# Altium schematic sheet Deign_1.SchDoc
size A; SheetNumber: 1; SheetTotal: 1; SPICEModelCacheXQTMULPK: <root> / <DocumentId>XQTMULPK</DocumentId> / <CacheFrame Number="0"> / <Model Name="2n3904" Kind="MDL"> / <Text>*2N3904 / *Si 310mW  40V 200mA 300MHz pkg:TO-92B 1,2,3 / .MODEL 2N3904 NPN(IS=1.4E-14 BF=300 VAF=100 IKF=0.025 ISE=3E-13 / + BR=7.5 RC=2.4 CJE=4.5E-12 TF=4E-10 CJC=3.5E-12 TR=2.1E-8 XTB=1.5 KF=9E-16 )</Text> / </Model> / </CacheFrame> / </root>
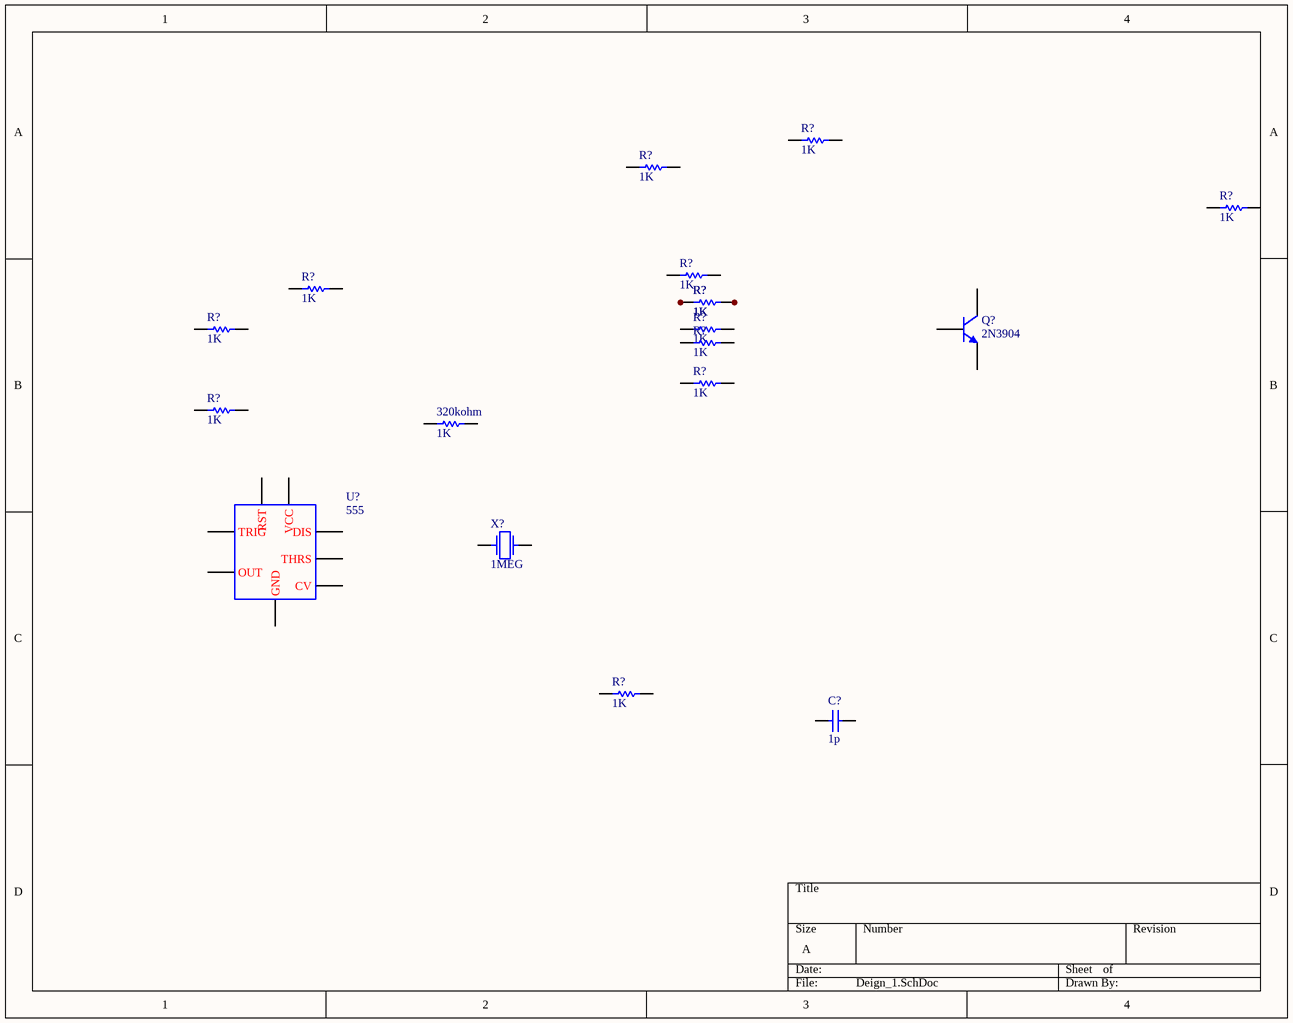
[diagram p0: Deign_1.SchDoc]

## Parts
(Parts that share a designator on the sheet are numbered #1, #2 ... from top to bottom, then left to right.)
320kohm  value 1K  (hidden comment: Resistor)
C?  value 1p  (hidden comment: Capacitor)
Q?  2N3904  [TO-92A]
R?#1  value 1K  (hidden comment: Resistor)
R?#2  value 1K  (hidden comment: Resistor)
R?#3  value 1K  (hidden comment: Resistor)
R?#4  value 1K  (hidden comment: Resistor)
R?#5  value 1K  (hidden comment: Resistor)
R?#6  value 1K  (hidden comment: Resistor)
R?#7  value 1K  (hidden comment: Resistor)
R?#8  value 1K  (hidden comment: Resistor)
R?#9  value 1K  (hidden comment: Resistor)
R?#10  value 1K  (hidden comment: Resistor)
R?#11  value 1K  (hidden comment: Resistor)
R?#12  value 1K  (hidden comment: Resistor)
R?#13  value 1K  (hidden comment: Resistor)
R?#14  value 1K  (hidden comment: Resistor)
U?  555
X?  F0: 1MEG  (hidden comment: Crystal)

## Nets
NetR?#6_1: R?#6.1 R?#7.1 R?#8.1
NetR?#6_2: R?#6.2 R?#7.2 R?#8.2

Not connected (* = marked no-connect by the designer): 320kohm 1 2; C? 1 2; Q? 1(E) 2(B) 3(C); R?#1 1 2; R?#2 1 2; R?#3 1 2; R?#4 1 2; R?#5 1 2; R?#9 1 2; R?#10 1 2; R?#11 1 2; R?#12 1 2; R?#13 1 2; R?#14 1 2; U? 1(GND) 2(TRIG) 3(OUT) 4(RST) 5(CV) 6(THRS) 7(DIS) 8(VCC); X? 1 2

## Library data of the parts
320kohm R?#1-R?#14 = Resistor: TC1: 0; SimulationGenericComponent: True; TC2: 0
C? = Capacitor: SimulationGenericComponent: True
Q? = 2N3904: NPN General Purpose Amplifier; Published: 8-Jun-2000; LatestRevisionDate: 15-Jan-2003; LatestRevisionNote: PCB Footprint 'BCY-W3/D4.7' replaced; DatasheetVersion: 1997; PackageVersion: Sep-1998; PackageReference: TO-92A; Publisher: Altium Limited; PackageDescription: TO, Flat Index; 3 In-Line, Axial Leads; Body Dia. 4.5mm; Leads 0.51 x 0.48 mm (max); ComponentLink1Description: Manufacturer Link; ComponentLink1URL: http://www.fairchildsemi.com/; ComponentLink2Description: Datasheet; ComponentLink2URL: http://www.fairchildsemi.com/ds/2N%2F2N3904.pdf
U? = 555: Timer 555; SimulationGenericComponent: True
X? = Crystal: R: 500; Q: 50K; SimulationGenericComponent: True